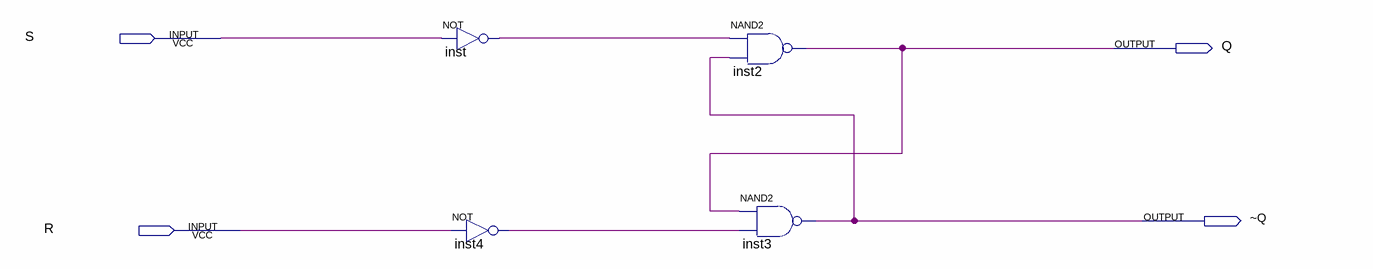
[diagram p0: schematic sheet]
// Quartus schematic Lab9step11.bdf as structural Verilog: 4 symbols, 4 pins
module Lab9step11 (
  input  S,
  input  R,
  output Q,
  output \~Q 
);

  wire inst4_out, inst_out;

  not inst (inst_out, S);
  not inst4 (inst4_out, R);
  nand inst2 (Q, inst_out, \~Q );
  nand inst3 (\~Q , Q, inst4_out);
endmodule
